# Altium schematic sheet KeypadConnection.SchDoc
size A4; DocumentNumber: 4; SheetNumber: 4; SheetTotal: 7
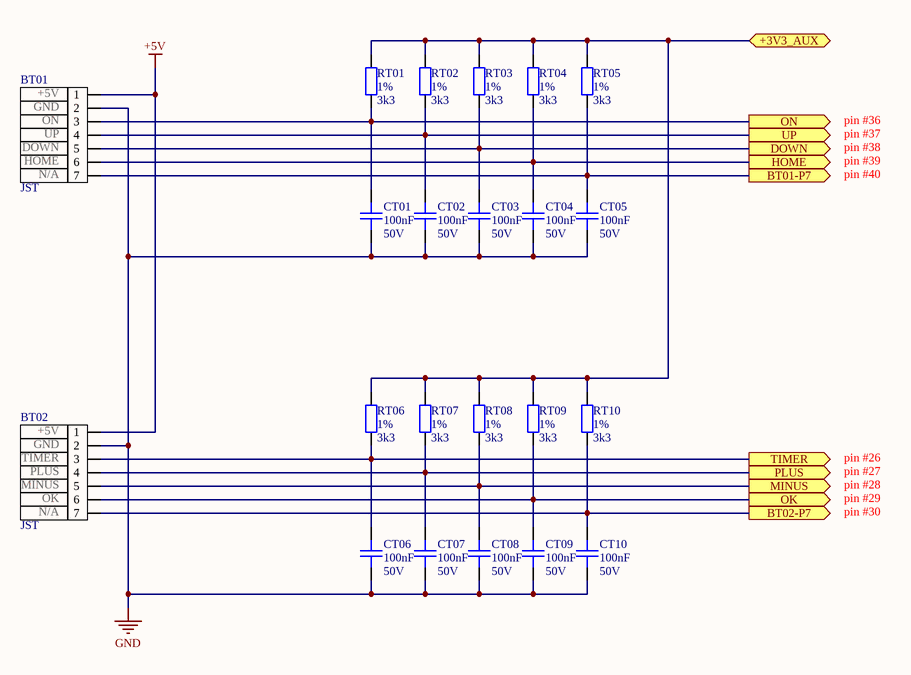
[diagram p0: KeypadConnection.SchDoc]

## Parts
BT01  JST  pin_1: +5V  pin_2: GND  pin_3: ON  pin_4: UP  pin_5: DOWN  pin_6: HOME
BT02  JST  pin_1: +5V  pin_2: GND  pin_3: TIMER  pin_4: PLUS  pin_5: MINUS  pin_6: OK
CT01  Capacitance: 100nF  Voltage Rating: 50V  [CAPC1608X08N_0603]  (hidden comment: CAP CER 0.1uF ±10% 50V X7R 0603)
CT02  Capacitance: 100nF  Voltage Rating: 50V  [CAPC1608X08N_0603]  (hidden comment: CAP CER 0.1uF ±10% 50V X7R 0603)
CT03  Capacitance: 100nF  Voltage Rating: 50V  [CAPC1608X08N_0603]  (hidden comment: CAP CER 0.1uF ±10% 50V X7R 0603)
CT04  Capacitance: 100nF  Voltage Rating: 50V  [CAPC1608X08N_0603]  (hidden comment: CAP CER 0.1uF ±10% 50V X7R 0603)
CT05  Capacitance: 100nF  Voltage Rating: 50V  [CAPC1608X08N_0603]  (hidden comment: CAP CER 0.1uF ±10% 50V X7R 0603)
CT06  Capacitance: 100nF  Voltage Rating: 50V  [CAPC1608X08N_0603]  (hidden comment: CAP CER 0.1uF ±10% 50V X7R 0603)
CT07  Capacitance: 100nF  Voltage Rating: 50V  [CAPC1608X08N_0603]  (hidden comment: CAP CER 0.1uF ±10% 50V X7R 0603)
CT08  Capacitance: 100nF  Voltage Rating: 50V  [CAPC1608X08N_0603]  (hidden comment: CAP CER 0.1uF ±10% 50V X7R 0603)
CT09  Capacitance: 100nF  Voltage Rating: 50V  [CAPC1608X08N_0603]  (hidden comment: CAP CER 0.1uF ±10% 50V X7R 0603)
CT10  Capacitance: 100nF  Voltage Rating: 50V  [CAPC1608X08N_0603]  (hidden comment: CAP CER 0.1uF ±10% 50V X7R 0603)
RT01  Tolerance: 1%  Resistance: 3k3  [Resistor-0603]  (hidden comment: R 3kΩ ±1% 0603 0.1W)
RT02  Tolerance: 1%  Resistance: 3k3  [Resistor-0603]  (hidden comment: R 3kΩ ±1% 0603 0.1W)
RT03  Tolerance: 1%  Resistance: 3k3  [Resistor-0603]  (hidden comment: R 3kΩ ±1% 0603 0.1W)
RT04  Tolerance: 1%  Resistance: 3k3  [Resistor-0603]  (hidden comment: R 3kΩ ±1% 0603 0.1W)
RT05  Tolerance: 1%  Resistance: 3k3  [Resistor-0603]  (hidden comment: R 3kΩ ±1% 0603 0.1W)
RT06  Tolerance: 1%  Resistance: 3k3  [Resistor-0603]  (hidden comment: R 3kΩ ±1% 0603 0.1W)
RT07  Tolerance: 1%  Resistance: 3k3  [Resistor-0603]  (hidden comment: R 3kΩ ±1% 0603 0.1W)
RT08  Tolerance: 1%  Resistance: 3k3  [Resistor-0603]  (hidden comment: R 3kΩ ±1% 0603 0.1W)
RT09  Tolerance: 1%  Resistance: 3k3  [Resistor-0603]  (hidden comment: R 3kΩ ±1% 0603 0.1W)
RT10  Tolerance: 1%  Resistance: 3k3  [Resistor-0603]  (hidden comment: R 3kΩ ±1% 0603 0.1W)

## Ports
+3V3_AUX, BT01-P7 (out), BT02-P7 (out), DOWN (out), HOME (out), MINUS (out), OK (out), ON (out), PLUS (out), TIMER (out), UP (out)

## Nets
+5V: BT01.1 BT02.1
GND: BT01.2 BT02.2 CT01.1 CT02.1 CT03.1 CT04.1 CT05.1 CT06.1 CT07.1 CT08.1 CT09.1 CT10.1
+3V3_AUX: RT01.2 RT02.2 RT03.2 RT04.2 RT05.2 RT06.2 RT07.2 RT08.2 RT09.2 RT10.2 ; port +3V3_AUX
BT01-P7: BT01.7 CT05.2 RT05.1 ; port BT01-P7
BT02-P7: BT02.7 CT10.2 RT10.1 ; port BT02-P7
DOWN: BT01.5 CT03.2 RT03.1 ; port DOWN
HOME: BT01.6 CT04.2 RT04.1 ; port HOME
MINUS: BT02.5 CT08.2 RT08.1 ; port MINUS
OK: BT02.6 CT09.2 RT09.1 ; port OK
ON: BT01.3 CT01.2 RT01.1 ; port ON
PLUS: BT02.4 CT07.2 RT07.1 ; port PLUS
TIMER: BT02.3 CT06.2 RT06.1 ; port TIMER
UP: BT01.4 CT02.2 RT02.1 ; port UP

## Notes on the sheet
- pin #38
- pin #37
- pin #36
- pin #40
- pin #39
- pin #26
- pin #27
- pin #28
- pin #29
- pin #30
- Title
- Size:
- Date:
- A4
- Number:
- Time:
- Revision:
- Sheet
- of
- File:

## Library data of the parts
BT01 BT02 = CONN FFC 7POS 1MM: pin_7: N/A
CT01 CT02 CT03 CT04 CT05 CT06 CT07 CT08 CT09 CT10 = CAP CER 0.1uF ±10% 50V X7R 0603: Capacitor; Manufacturer: KEMET; Manufacturer Part Number: C0603C104M5RACTU; Dielectric Material: Ceramic; Tolerance: 20%; Dissipation Factor: 2.5%; Supplier 1: Digi-Key; Stock 1: 1202175; Pricing 1: 1=0.1, 10=0.039, 50=0.0204, 100=0.0174, 500=0.0124, 1000=0.0097 (USD); Mount: Surface Mount,PCB; Case/Package: 0603; Case Code (Metric): 1608; Case Code (Imperial): 0603; Contact Plating: Tin,Matte; Min Operating Temperature: -55°C; Max Operating Temperature: 125°C; Package Quantity: 1; Packaging: Tape and Reel; Voltage Rating (DC): 50V; Dielectric: X7R; Termination: SMD/SMT; Length: 1.6mm; Height: 0.8mm; Width: 0.031inch; Thickness: 0.034inch; Lead Pitch: 0.7mm; Depth: 0.8mm; Radiation Hardening: No; REACH SVHC: No SVHC; ComponentLink1URL: http://www.farnell.com/datasheets/2746056.pdf?src-supplier=Element14; ComponentLink1Description: http://www.farnell.com/datasheets/2746056.pdf?src-supplier=Element14; ComponentLink2URL: http://www.mouser.com/ds/2/212/KEM_C1002_X7R_SMD-1102033.pdf?src-supplier=Mouser; ComponentLink2Description: http://www.mouser.com/ds/2/212/KEM_C1002_X7R_SMD-1102033.pdf?src-supplier=Mouser; ComponentLink3URL: https://www.verical.com/server-webapp/html/getDatasheet?partID=626892&src-supplier=Verical; ComponentLink3Description: https://www.verical.com/server-webapp/html/getDatasheet?partID=626892&src-supplier=Verical; ComponentLink4URL: http://components.arrow.com/part/dataview/40911037S8853915N7429?src-supplier=Arrow; ComponentLink4Description: http://components.arrow.com/part/dataview/40911037S8853915N7429?src-supplier=Arrow; ComponentLink5URL: http://capacitoredge.kemet.com/capedge2/DataSheet?pn=C0603C104M5RAC7867&src-supplier=Avnet; ComponentLink5Description: http://capacitoredge.kemet.com/capedge2/DataSheet?pn=C0603C104M5RAC7867&src-supplier=Avnet; ComponentLink6URL: http://capacitoredge.kemet.com/capedge2/DataSheet?pn=C0603C104M5RAC7867&src-supplier=Avnet+Asia; ComponentLink6Description: http://capacitoredge.kemet.com/capedge2/DataSheet?pn=C0603C104M5RAC7867&src-supplier=Avnet+Asia; ComponentLink7URL: http://www.farnell.com/datasheets/2746056.pdf?src-supplier=Farnell; ComponentLink7Description: http://www.farnell.com/datasheets/2746056.pdf?src-supplier=Farnell; ComponentLink8URL: http://www.farnell.com/datasheets/2746056.pdf?src-supplier=Newark; ComponentLink8Description: http://www.farnell.com/datasheets/2746056.pdf?src-supplier=Newark; ComponentLink9URL: http://www.alliedelec.com/m/d/6f3b5eb83d09db50ed28bdc730567b33.pdf?src-supplier=Allied+Electronics; ComponentLink9Description: http://www.alliedelec.com/m/d/6f3b5eb83d09db50ed28bdc730567b33.pdf?src-supplier=Allied+Electronics; ComponentLink10URL: https://api.kemet.com/component-edge/download/datasheet/C0603C104M5RACTU.pdf?src-supplier=Digi-Key; ComponentLink10Description: https://api.kemet.com/component-edge/download/datasheet/C0603C104M5RACTU.pdf?src-supplier=Digi-Key; ComponentLink11URL: http://www.farnell.com/datasheets/2315113.pdf?src-supplier=Newark; ComponentLink11Description: http://www.farnell.com/datasheets/2315113.pdf?src-supplier=Newark; ComponentLink12URL: http://www.farnell.com/datasheets/1828800.pdf?src-supplier=Newark; ComponentLink12Description: http://www.farnell.com/datasheets/1828800.pdf?src-supplier=Newark; ComponentLink13URL: http://components.arrow.com/part/dataview/0323_00313986?src-supplier=Arrow+Europe; ComponentLink13Description: http://components.arrow.com/part/dataview/0323_00313986?src-supplier=Arrow+Europe; ComponentLink14URL: https://www.verical.com/server-webapp/html/getDatasheet?partID=110138&src-supplier=Verical; ComponentLink14Description: https://www.verical.com/server-webapp/html/getDatasheet?partID=110138&src-supplier=Verical; Supplier Part Number 1: 399-7845-1-ND
RT01 RT02 RT03 RT04 RT05 RT06 RT07 RT08 RT09 RT10 = R 3kΩ ±1% 0603 0.1W: Resistor; Manufacturer: Yageo; Manufacturer Part Number: RC0603FR-073KL; Temperature Coefficient: 100ppm/°C; Power Rating: 100mW; Voltage Rating: 50V; Supplier 1: Digi-Key; Stock 1: 3150938; Pricing 1: 1=0.1, 10=0.024, 100=0.0097, 1000=0.0044, 2500=0.0038 (USD); Case/Package: 0603; Number of Pins: 2; Case Code (Imperial): 0603; Case Code (Metric): 1608; Min Operating Temperature: -55°C; Max Operating Temperature: 155°C; Packaging: Tape and Reel; Composition: Thick Film; Termination: SMD/SMT; Voltage Rating (DC): 50V; Military Standard: Not; Length: 1.6mm; Width: 800um; Depth: 0.8mm; Lead Free: Lead Free; REACH SVHC: No SVHC; Supplier Part Number 1: 311-3.00KHRCT-ND